# Altium schematic sheet power-supply.SchDoc
size A4; SheetNumber: 4; SheetTotal: 5
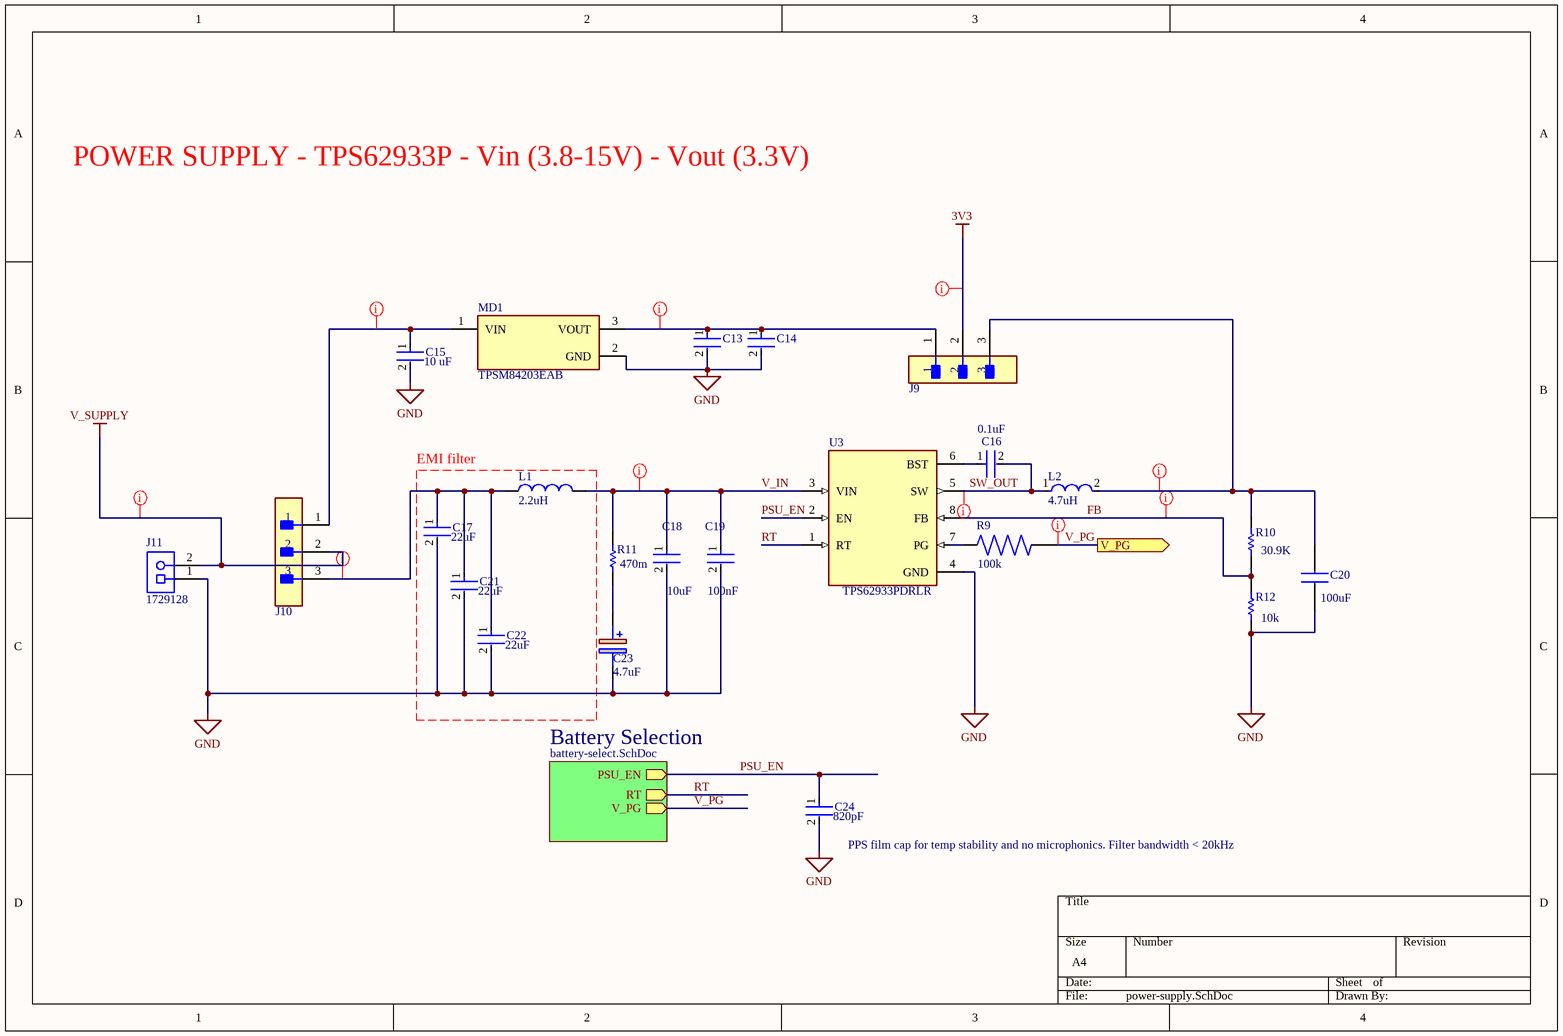
[diagram p0: power-supply.SchDoc]

## Parts
C13  (no value)  [FP-C3216-160-0_2-MFG]
C14  (no value)  [FP-C3216-160-0_2-MFG]
C15  10 uF  [FP-GRT31C-0_2-IPC_A]
C16  0.1uF  [FP-C0603C104Z4VACTU-MFG]
C17  22uF  [FP-GRM32-MFG]
C18  10uF  [FP-GRM21B-0_15-IPC_A]
C19  100nF  [FP-0603-L_1_6_0_15-W_0_81-MFG]
C20  100uF  [CAPC3225X270N]
C21  22uF  [FP-GRM32-MFG]
C22  22uF  [FP-GRM32-MFG]
C23  4.7uF  [CAPPM3528X120N]
C24  Capacitance: 820pF  [FP-ECHUJ1-MFG]  (hidden comment: ECH-U1H821JX5)
J9  PREC003SAAN-RC  [FP-PREC003SAAN-RC-MFG]  (value not drawn)
J10  3POS_MALECONN-2.54mm  [SIP3-100mil]  (value not drawn)
J11  1729128  [PHOE-1729128-2_V]
L1  2.2uH  [WE-PMCI_1210_L3.2W2.5H1.2]
L2  4.7uH  [FP-IHLP-3232DZ-FP_2_413x5-MFG]
MD1  TPSM84203EAB  [FP-EAB0003A-MFG]
R9  100k  [RESC1508X50N]
R10  30.9K  [RESC1608X55X25NL10T15]
R11  value 470m  [RESC2013X70X40NL20T20]  (hidden comment: ERJ-6RQFR47V)
R12  10k  [RESC1609X50X30NL8T20]
U3  TPS62933PDRLR  [SOFL50P160X60-8S]

## Sub-sheets
Battery Selection = battery-select.SchDoc: V_PG (out), PSU_EN (out), RT (out)

## Ports
V_PG (out)

## Nets
3V3: J9.2
GND: C13.2 C14.2 C15.2 C17.2 C18.2 C19.2 C20.1 C21.2 C22.2 C23.2(-) C24.2 J11.1 MD1.2(GND) R12.1 U3.4(GND)
V_SUPPLY: J10.2 J11.2
FB: R10.1 R12.2 U3.8(FB)
PSU_EN: C24.1 U3.2(EN) ; sheet Battery Selection/PSU_EN
RT: U3.1(RT) ; sheet Battery Selection/RT
SW_OUT: C16.2 L2.1 U3.5(SW)
V_IN: C18.1 C19.1 L1.2 R11.2 U3.3(VIN)
V_PG: R9.2 ; port V_PG, sheet Battery Selection/V_PG
NetC13_1: C13.1 C14.1 J9.1 MD1.3(VOUT)
NetC15_1: C15.1 J10.1 MD1.1(VIN)
NetC16_1: C16.1 U3.6(BST)
NetC17_1: C17.1 C21.1 C22.1 J10.3 L1.1
NetC20_2: C20.2 J9.3 L2.2 R10.2
NetC23_1: C23.1(+) R11.1
NetR9_1: R9.1 U3.7(PG)

## Layout directives
net class PWR_SUPPLY: NetC15_1, NetC17_1, V_IN, V_SUPPLY
net class ANALOG: FB
net class PWR_REG: 3V3, NetC13_1, NetC20_2, SW_OUT
net class DIGITAL: V_PG

## Notes on the sheet
- POWER SUPPLY - TPS62933P - Vin (3.8-15V) - Vout (3.3V)
- (near L1) EMI filter
- (near C24) PPS film cap for temp stability and no microphonics. Filter bandwidth < 20kHz

## Library data of the parts
C13 C14 = CMP-2000-05397-3: Multilayer Ceramic Capacitors 47uF ±20% 25V X5R SMD 1206; Weight: 0.000571oz; Dielectric: X5R; Length: 0.126inch; Voltage Rating: 25V; Case/Package: 1206; Dielectric Material: Ceramic; Min Operating Temperature: -55°C; Lead Free: Lead Free; Packaging: Tape and Reel; Package Quantity: 1; Mount: Surface Mount; Depth: 1.6mm; REACH SVHC: No SVHC; Termination: SMD/SMT; Case Code (Imperial): 1206; Series: C; Resistor Type: Ceramic; Voltage: 25V; Width: 0.063inch; Height: 1.6mm; Tolerance: 20%; Capacitance: 47uF; Max Operating Temperature: 85°C; Voltage Rating (DC): 25V; RoHS Compliant: Yes; Thickness: 0.071inch; Case Code (Metric): 3216
C15 = CMP-06035-000076-2: Multi-Layer Ceramic Capacitor 10uF 50V X5R ±10% 1206 Emboss T/R; Length: 0.126inch; Max Operating Temperature: 85°C; Width: 0.063inch; Ratings: AEC-Q200; Voltage Rating: 50V; Dielectric: X5R; Min Operating Temperature: -55°C; Case Code (Imperial): 1206; Capacitance: 10uF; Case Code (Metric): 3216; Thickness: 0.071inch; Tolerance: 10%; Mount: Surface Mount; Case/Package: 1206; Packaging: Cut Tape; Voltage Rating (DC): 50V
C16 = CMP-2006-03071-2: CAP CER 0.1UF 16V Y5V 0603; Tolerance: 80%; Capacitance: 100nF; Dielectric Material: Ceramic; Radiation Hardening: No; Lead Free: Lead Free; Package Quantity: 4000; Voltage Rating: 16V; Width: 0.031inch; Thickness: 0.034inch; Max Operating Temperature: 85°C; Case/Package: 0603; Depth: 0.8mm; Case Code (Metric): 1608; Voltage Rating (DC): 16V; Packaging: Tape and Reel; Min Operating Temperature: -30°C; REACH SVHC: No SVHC; Lead Pitch: 0.7mm; Case Code (Imperial): 0603; Series: C; Termination: SMD/SMT; RoHS Compliant: Yes; Length: 1.6mm; Height: 0.8mm; Construction: Flat; Dielectric: Y5V; Mount: Surface Mount; Number of Pins: 2
C17 C21 C22 = CMP-2000-05458-2: CAP CER 22UF 25V X5R 1210; Manufacturer: Murata Electronics North America; Manufacturer Part Number: GRM32ER61E226KE15L; Possible Substitute: GRM32ER61E226KE15K; Other Names: 490-3889-2; Material: Ceramic; Tolerance: 10%; Digikey Description: CAP CER 22UF 25V X5R 1210; Mouser Description: Multilayer Ceramic Capacitors MLCC - SMD/SMT 1210 22uF 25volts X5R 10%; Device Class L2: Capacitors; Height: 2.7mm; Temperature Characteristic: X5R; Category: Cap; RoHS: TRUE; Operating Temperature: -55°C ~ 85°C; Temperature: -55°C to +85°C; Lead Free: Yes; Package: GRM32; Temperature Range High: +85°C; Package / Case: 1210 (3225 Metric); Standard Package: 1,000; Packaging: Cut Tape (CT); Capacitance: 22uF; Thickness (Max): 0.106" (2.70mm); Value: 22uF; Automotive: No; Device Class L1: Passive Components; Voltage - Rated: 25V; Temperature Range Low: -55°C; Size / Dimension: 0.126" L x 0.098" W (3.20mm x 2.50mm); ComponentLink2Description: Datasheet; Device Class L3: Ceramic Capacitors; Temperature Coefficient: X5R; ComponentLink2URL: https://search.murata.co.jp/Ceramy/image/img/A01X/G101/ENG/GRM32ER61E226KE15-01A.pdf; Voltage Rating: 25V; Octopart: https://octopart.com/grm32er61e226ke15l-murata-197441; Applications: General Purpose; Mounting Type: Surface Mount, MLCC
C18 = CMP-06035-013048-1: Chip Multilayer Ceramic Capacitors for General Purpose, 0805, 10uF, X5R, 15%, 20%, 25V; Max Operating Temperature: 85°C; Package Quantity: 3000; Case/Package: 0805; Depth: 1.25mm; Case Code (Imperial): 0805; Termination: SMD/SMT; Width: 0.049inch; Packaging: Tape and Reel; Tolerance: 20%; Height: 1.25mm; Min Operating Temperature: -55°C; Capacitance: 10uF; Weight: 0.000335oz; Voltage Rating (DC): 25V; Dielectric: X5R; Length: 2mm; Thickness: 0.055inch; Voltage Rating: 25V; Resistor Type: Ceramic; Lead Free: Lead Free; Case Code (Metric): 2012; Mount: Surface Mount; REACH SVHC: No SVHC
C19 = CMP-2006-04157-2: General Purpose Ceramic Capacitor, 0603, 100nF, 10%, X7R, 15%, 25V; Termination: SMD/SMT; Voltage Rating: 25V; Mount: Surface Mount; Number of Pins: 2; Contact Plating: Tin; Case Code (Imperial): 0603; Construction: Flat; Max Operating Temperature: 125°C; Voltage: 25V; Height: 0.9mm; Thickness: 0.035inch; Case Code (Metric): 1608; Case/Package: 0603; Capacitance: 100nF; Length: 1.6mm; Dielectric: X7R; Width: 0.032inch; Series: -; Min Operating Temperature: -55°C; Package Quantity: 4000; REACH SVHC: No SVHC; RoHS Compliant: Yes; Voltage Rating (DC): 25V; Depth: 0.81mm; Packaging: Tape and Reel; Lead Free: Lead Free; Radiation Hardening: No; Tolerance: 10%
C20 = GRM32EC80J107ME20L: Cout - Murata 1210 GRM 100uF Ceramic Multilayer Capacitor, 6.3 V dc, +105C, X6S Dielectric, +/-20% SMD; Manufacturer_Name: Murata Electronics; Geometry.Height: 2.7mm; Mouser Part Number: 81-GRM32EC80J107ME0L; Mouser Price/Stock: https://www.mouser.co.uk/ProductDetail/Murata-Electronics/GRM32EC80J107ME20L?qs=eCxWOFGThBZyUCwIudAIww%3D%3D; Manufacturer_Part_Number: GRM32EC80J107ME20L; Datasheet Link: http://psearch.en.murata.com/capacitor/product/GRM32ER71E226KE15%23.pdf
C23 = TPSB475K035R0700: Cap Tant Solid 4.7uF 35V B CASE 10% (3.5 X 2.8 X 1.9mm) Inward L SMD 3528-21 0.7 Ohm 125C T/R; Manufacturer_Name: Kyocera AVX; Geometry.Height: 1.2mm; Mouser Part Number: 581-TPSB475K035R0700; Mouser Price/Stock: https://www.mouser.co.uk/ProductDetail/AVX/TPSB475K035R0700?qs=vV7MX5mTKGOnhbxp1nxMNw%3D%3D; Manufacturer_Part_Number: TPSB475K035R0700; Datasheet Link: http://datasheets.avx.com/TPS.pdf
C24 = CMP-05434-000008-1: CAP FILM 820PF 5% 50VDC 0805; Life (Hours): 500Hour; Voltage Rating (DC): 50V; Dielectric: PPS; Dielectric Material: Polyphenylene; Construction: Flat; Tolerance: 5%; Height - Seated (Max): 0.043inch; Height: 0.9mm; Width: 1.25mm; REACH SVHC: No SVHC; Min Operating Temperature: -55°C; Case Code (Metric): 2012; Radiation Hardening: No; Series: ECHU(X); Max Operating Temperature: 125°C; Case Code (Imperial): 0805; RoHS Compliant: Yes; Voltage Rating: 50V; Termination: SMD/SMT; Contact Plating: Copper; Depth: 1.25mm; Length: 2mm; Packaging: Tape and Reel; Case/Package: 0805; Package Quantity: 3000; Voltage: 50V; Mount: Surface Mount
J9 = CMP-00595-22265080-1: PREC003SAAN-RC Conn Header Vert 3POS 2.54MM; Number of Contacts: 3; Connector Type: Male Pin; Current Rating: 3A; Height: 8.74mm; Contact Mating Length: 5.842mm; Min Operating Temperature: -40°C; Termination: Solder; Packaging: Bulk; Pitch: 2.54mm; Color: Black; Mount: Through Hole; Contact Material: Nickel, Tin; Number of Rows: 1; NexarPartId: 22265080; Max Operating Temperature: 105°C; RoHS: Compliant; Contact Plating: Tin; Number of Positions: 3
J10 = 3POS_MALECONN-2.54mm: Vertical male 3 position connector 2.54mm pitch; NexarPartId: 22265080; Current Rating: 3A; Number of Contacts: 3; Connector Type: Male Pin; RoHS: Compliant; Pitch: 2.54mm; Height: 8.74mm; Contact Mating Length: 5.842mm; Min Operating Temperature: -40°C; Termination: Solder; Packaging: Bulk; Color: Black; Mount: Through Hole; Contact Material: Nickel, Tin; Number of Rows: 1; Max Operating Temperature: 105°C; Contact Plating: Tin; Number of Positions: 3; Supplier 1: Digikey; Supplier Part Number 1: S1012EC-03-ND
J11 = CMP-2000-05815-1: PCB Terminal Block, 13.5 A, 400 V, 2-Pin THD, RoHS, Bulk; Manufacturer: Phoenix Contact; Pitch: 5.08mm; Current Rating: 13500mA; Package Version: 03/2015; No. of Rows: 1; No. of Positions: 2; Voltage Rating: 400V; RoHS: TRUE; Manufacturer URL: http://www.phoenixcontact.com/; Datasheet URL: https://datasheet.ciiva.com/16046/1729128-16046181.pdf; Package URL: https://www.phoenixcontact.com/online/portal/pi/pxc/product_detail_page/!ut/p/b1/3VdJjqNKFDxLH8AFycySyWY2ozFsEPOMMQaDOX1XedGL_1Vdm5YXJleknhSKeBkvI6EA8ncAo3AYoDhBQGco6KN7VURTdemj9us_IEKEZo_YHiPAEWEFmDGOHMORkqKYCORBZxgL7ZoaZYcbFFUZ3fqxSY6GOuxydWUuHqz1ynmMFygu583Bob0Ewr6Sd_l-5m-kAueHiB0jpRwZwe58wwtkpxtMYd_LmGcDRU02dRNEyWt6Y2ti5pSyJ_reIkzIulrqApdnbT11V5jnCKbYNCvhEM1MCpPByat_X379-iThf08CI5GfOPqfBeS3BRoBOdD55AKVv0iLwCMq-2BrzXWSGRH7pUGD9uwXQjiph3xL0DKQwdGa0JImiIOmBNOestqgwTHSSs2oOep-78apyXQBvNi8ZLaFjvjWvcaUEBu0MC6Wbe-d6mB0FAebo2lUWinqYaZs5DAYzV0RP9yitUjnGJ0iI9xhZkT42OCQNUJJhkgWINNQLP2JFP6OpMg3JCVg70jqHT0lvKOnhHf0lPuOnnLf0VPuWx6_dxwUIvwk5WMkT0kLL1mh61l2yZVSzG3pYV_bqo-mj6uMKwKwdnnW8Jh5RTOJzMOA5c-eJDaZQw4mTMPH02PvS_ZAqNVjVTo2WyYLkwH_KU1mmmG5kjRhDqPXLwwVHvVOjCM60-fpXvTDfMGW1PVFVS1r4e4yVDk4ZdNbkUHvqPqQSeian4UD39fNKmachqdJ1NJbyk8rXT9mXTvPk3oE5meulKGgiruPJek-4I9hTT6G8ZLOyRSm2RRVbThERQad5OS28hdt4YW4vG0stgYYzsWsK4_7y6DZMjJSCqri1kyiZR5vD7pwIrNR7QwPHTcLTI5qT7eRlpHrdGiupYlqQDJ7zy_CND8fWWBoLRXxk1RVcXiBQwbTD4Xi7KL-FuO94t9xaqweXzH; PartNumber: 1729128; Package Description: 2-Pin Through Hole Device, Body 8.1 x 10.16 mm, Pitch 5.08 mm; Datasheet Version: 12/2013; Mounting Technology: ThroughHole; Orientation: Horizontal; Package Reference: 1729128-2; Packing: Bulk
L1 = CMP-03913-71101468-1: 74479299222 General Purpose Inductor, 2.2uH, 15%, 1 Element, Iron Alloy-Core, SMD, 1210; Inductance Tolerance: 20%; Shielding: Shielded; Saturation Current: 3.5A; Test Frequency: 1MHz; DC Resistance (DCR): 70mΩ; Self Resonant Frequency: 25MHz; Current Rating: 2.1A; Inductance: 2.2µH; Case Code (Metric): 3225; Case Code (Imperial): 1210; Min Operating Temperature: -40°C; Width: 2.5mm; Height - Seated (Max): 1.1938mm; NexarPartId: 71101468; Mount: Surface Mount; Length: 3.2mm; Ambient Temperature Range Low: -40°C; Number of Pins: 2; Ambient Temperature Range High: 85°C; RoHS: Compliant; REACH SVHC: Unknown; Max Operating Temperature: 125°C; Tolerance: 20%; Case/Package: 1210; Height: 1.2mm
L2 = CMP-02424-000021-1: Commercial Inductors, Low DCR Series 4.7uH 8A 22.6mΩ 20%; Self Resonant Frequency: 17MHz; Test Frequency: 100kHz; Core Material: Ferrite; Saturation Current: 8.7A; DC Resistance (DCR): 22.6mR; Shielding: Shielded; Current Rating: 8A; Packaging: Tape and Reel; RMS Current (Irms): 8A; Min Operating Temperature: -55°C; Tolerance: 20%; Contact Plating: Tin; Width: 8.18mm; Inductance: 4.7uH; Number of Pins: 2; Inductance Tolerance: 20%; Height: 4mm; Mount: Surface Mount; Package Quantity: 500; Lead Free: Lead Free; Max DC Current: 8A; Case/Package: 3232; Military Standard: Not; Max Operating Temperature: 125°C; Depth: 8.26mm; Length: 8.89mm; Termination: SMD/SMT; Height - Seated (Max): 0.157inch; Radiation Hardening: No
MD1 = TPS_EVAL_BOARD: Switching Regulator, Current-mode, 1.5A, 510kHz Switching Freq-Max, Hybrid; Manufacturer: Texas Instruments; RoHS Compliant: Yes; Manufacturer Part Number: TPSM84203EAB; Component Type: Power Supply
R9 = CRCW0603100KFKEA: Resistor, Thick Film, 100 Kilohms, 0.1W, 1%, SMT, TCR 37 ppm/DegC, Tape and Reel | Vishay Dale CRCW0603100KFKEA; SnapEDA_Link: https://www.snapeda.com/parts/CRCW0603100KFKEA/Vishay+Dale/view-part/?ref=snap; Package: 1508 Vishay; Value: *; MF: Vishay; MP: CRCW0603100KFKEA; Check_prices: https://www.snapeda.com/parts/CRCW0603100KFKEA/Vishay+Dale/view-part/?ref=eda
R10 = CMP-2000-04004-1: Rfbt; Manufacturer: Yageo; Part Number: RC0603FR-0730K9L
R11 = CMP-2001-00470-1: Manufacturer: Panasonic; Part Number: ERJ-6RQFR47V
R12 = CMP-1666-00005-4: Rfbb- Chip Resistor, 10 KOhm, +/- 1%, 100 mW, -55 to 155 degC, 0603 (1608 Metric), RoHS, Tape and Reel; Manufacturer: Vishay Semiconductor; Voltage Rating: 75 V; Max Operating Temperature: 155 degC; PackageDescription: 2-Pin Surface Mount Device, Body 1.575 x 0.85 mm; ComponentLink1Description: Manufacturer URL; RoHSCompliant: true; PackageReference: 0603; REACH SVHC: Unknown; Length: 1.55 mm; DatasheetVersion: 06/2012; Packaging: Tape and Reel; Min Operating Temperature: -55 degC; Mounting Technology: Surface Mount; ComponentLink2URL: https://datasheet.ciiva.com/11809/0900766b80d98afc-11809037.pdf; Height: 0.45 mm; ComponentLink2Description: Datasheet; Package Quantity: 5000; ComponentLink1URL: http://www.vishay.com/
U3 = TPS62933PDRLR: Package: None; Price: None; Value: *; MP: TPS62933PDRLR; Availability: Unavailable